# EAGLE design scT (EAGLE 8.6.3)
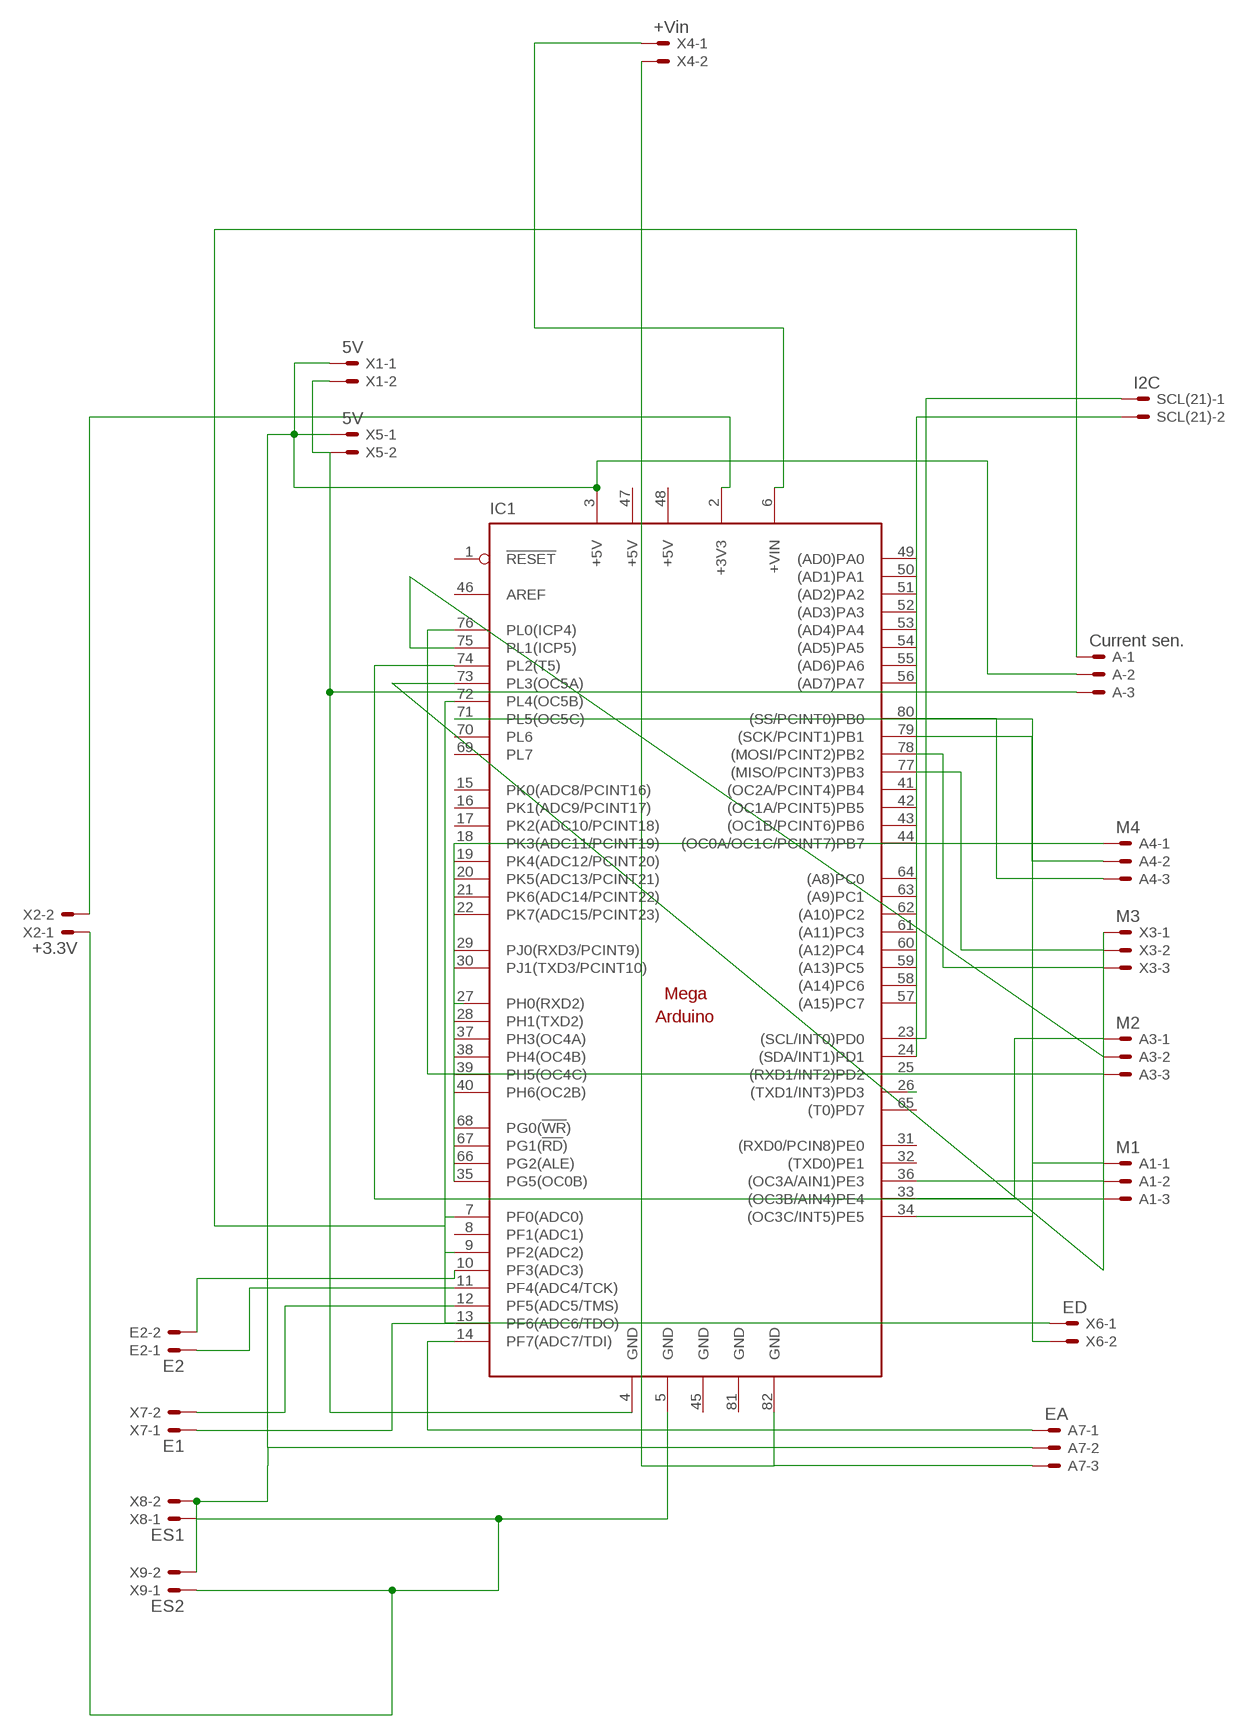
[diagram p0: schematic, sheet 1]

## Parts
A  Current sen.  JST-XH-03-PIN-LONG-PAD  [JST-XH-03-PACKAGE-LONG-PAD]
A1  M1  JST-XH-03-PIN-LONG-PAD  [JST-XH-03-PACKAGE-LONG-PAD]
A3  M2  JST-XH-03-PIN-LONG-PAD  [JST-XH-03-PACKAGE-LONG-PAD]
A4  M4  JST-XH-03-PIN-LONG-PAD  [JST-XH-03-PACKAGE-LONG-PAD]
A7  EA  JST-XH-03-PIN-LONG-PAD  [JST-XH-03-PACKAGE-LONG-PAD]
E2  E2  JST-XH-02-PIN-LONG-PAD  [JST-XH-02-PACKAGE-LONG-PAD]
IC1  MEGAARDUINO_11  [MEGA_ARDUINO_1]
SCL(21)  I2C  JST-XH-02-PIN-LONG-PAD  [JST-XH-02-PACKAGE-LONG-PAD]
X1  5V  JST-XH-02-PIN-LONG-PAD  [JST-XH-02-PACKAGE-LONG-PAD]
X2  +3.3V  JST-XH-02-PIN-LONG-PAD  [JST-XH-02-PACKAGE-LONG-PAD]
X3  M3  JST-XH-03-PIN-LONG-PAD  [JST-XH-03-PACKAGE-LONG-PAD]
X4  +Vin  JST-XH-02-PIN-LONG-PAD  [JST-XH-02-PACKAGE-LONG-PAD]
X5  5V  JST-XH-02-PIN-LONG-PAD  [JST-XH-02-PACKAGE-LONG-PAD]
X6  ED  JST-XH-02-PIN-LONG-PAD  [JST-XH-02-PACKAGE-LONG-PAD]
X7  E1  JST-XH-02-PIN-LONG-PAD  [JST-XH-02-PACKAGE-LONG-PAD]
X8  ES1  JST-XH-02-PIN-LONG-PAD  [JST-XH-02-PACKAGE-LONG-PAD]
X9  ES2  JST-XH-02-PIN-LONG-PAD  [JST-XH-02-PACKAGE-LONG-PAD]

## Nets
N$1: IC1.12(PF5(ADC5/TMS)) X7.2
N$2: A4.1 IC1.35(PG5(OC0B))
N$3: IC1.27(PH0(RXD2))
N$4: IC1.26((TXD1/INT3)PD3)
N$5: A4.2 IC1.79((SCK/PCINT1)PB1)
N$6: IC1.25((RXD1/INT2)PD2)
N$7: IC1.36((OC3A/AIN1)PE3) X3.1
N$8: A3.2 IC1.75(PL1(ICP5))
N$9: A3.1 IC1.33((OC3B/AIN4)PE4)
N$10: A1.1 IC1.34((OC3C/INT5)PE5)
N$11: IC1.77((MISO/PCINT3)PB3) X3.2
N$12: A3.3 IC1.76(PL0(ICP4))
N$13: IC1.2(+3V3) X2.2
N$14: A.1 IC1.7(PF0(ADC0))
N$15: A.3 IC1.4(GND) X1.2 X5.2
N$16: A4.3 IC1.80((SS/PCINT0)PB0)
N$17: IC1.9(PF2(ADC2))
N$18: E2.2 IC1.10(PF3(ADC3))
N$19: E2.1 IC1.11(PF4(ADC4/TCK))
N$20: IC1.78((MOSI/PCINT2)PB2) X3.3
N$21: IC1.13(PF6(ADC6/TDO)) X7.1
N$22: A1.2 IC1.73(PL3(OC5A))
N$23: A1.3 IC1.74(PL2(T5))
N$24: IC1.5(GND) X2.1 X8.1 X9.1
N$25: A7.2 A.2 IC1.3(+5V) X1.1 X5.1 X8.2 X9.2
N$26: IC1.72(PL4(OC5B)) X6.1
N$27: IC1.71(PL5(OC5C)) X6.2
N$28: A7.1 IC1.14(PF7(ADC7/TDI))
N$29: A7.3 IC1.82(GND) X4.2
N$30: IC1.23((SCL/INT0)PD0) SCL(21).1
N$31: IC1.24((SDA/INT1)PD1) SCL(21).2
N$32: IC1.6(+VIN) X4.1
Unconnected: IC1.1(!RESET) IC1.8(PF1(ADC1)) IC1.15(PK0(ADC8/PCINT16)) IC1.16(PK1(ADC9/PCINT17)) IC1.17(PK2(ADC10/PCINT18)) IC1.18(PK3(ADC11/PCINT19)) IC1.19(PK4(ADC12/PCINT20)) IC1.20(PK5(ADC13/PCINT21)) IC1.21(PK6(ADC14/PCINT22)) IC1.22(PK7(ADC15/PCINT23)) IC1.28(PH1(TXD2)) IC1.29(PJ0(RXD3/PCINT9)) IC1.30(PJ1(TXD3/PCINT10)) IC1.31((RXD0/PCIN8)PE0) IC1.32((TXD0)PE1) IC1.37(PH3(OC4A)) IC1.38(PH4(OC4B)) IC1.39(PH5(OC4C)) IC1.40(PH6(OC2B)) IC1.41((OC2A/PCINT4)PB4) IC1.42((OC1A/PCINT5)PB5) IC1.43((OC1B/PCINT6)PB6) IC1.44((OC0A/OC1C/PCINT7)PB7) IC1.46(AREF) IC1.49((AD0)PA0) IC1.50((AD1)PA1) IC1.51((AD2)PA2) IC1.52((AD3)PA3) IC1.53((AD4)PA4) IC1.54((AD5)PA5) IC1.55((AD6)PA6) IC1.56((AD7)PA7) IC1.57((A15)PC7) IC1.58((A14)PC6) IC1.59((A13)PC5) IC1.60((A12)PC4) IC1.61((A11)PC3) IC1.62((A10)PC2) IC1.63((A9)PC1) IC1.64((A8)PC0) IC1.65((T0)PD7) IC1.66(PG2(ALE)) IC1.67(PG1(!RD!)) IC1.68(PG0(!WR!)) IC1.69(PL7) IC1.70(PL6)

## Power pins joined to a net without a drawn wire
+5V: IC1.47(+5V) IC1.48(+5V)
GND: IC1.45(GND) IC1.81(GND)

## Library data of the parts
A A1 A3 A4 A7 X3 = jstt:JST-XH-03-PIN: JST XH Connector 2 Pin Wire to board connector. Pitch: 2,54 mm, (0.100") Number of pins: 3 Created by Rembrandt Electronics www.rembrandtelectronics.com
E2 SCL(21) X1 X2 X4-X9 = jstt:JST-XH-02-PIN: JST XH Connector 2 Pin Wire to board connector. Pitch: 2,54 mm, (0.100") Number of pins: 2 Created by Rembrandt Electronics www.rembrandtelectronics.com
IC1 = arduino:MEGAARDUINO_1: The Arduino Mega is a microcontroller board based on the ATmega1280. - 54 digital input/output pins (of which 14 can be used as PWM outputs) - 16 analog inputs - 4 UARTs (hardware serial ports) - 16 MHz crystal oscillator - USB connection - power jack - ICSP header - reset button It contains everything needed to support the microcontroller; simply connect it to a computer with a USB cable or power it with a AC-to-DC adapter or battery to get started. The Mega is compatible with most shields designed for the Arduino Duemilanove or Diecimila. http://arduino.cc/en/Main/ArduinoBoardMega

## Board
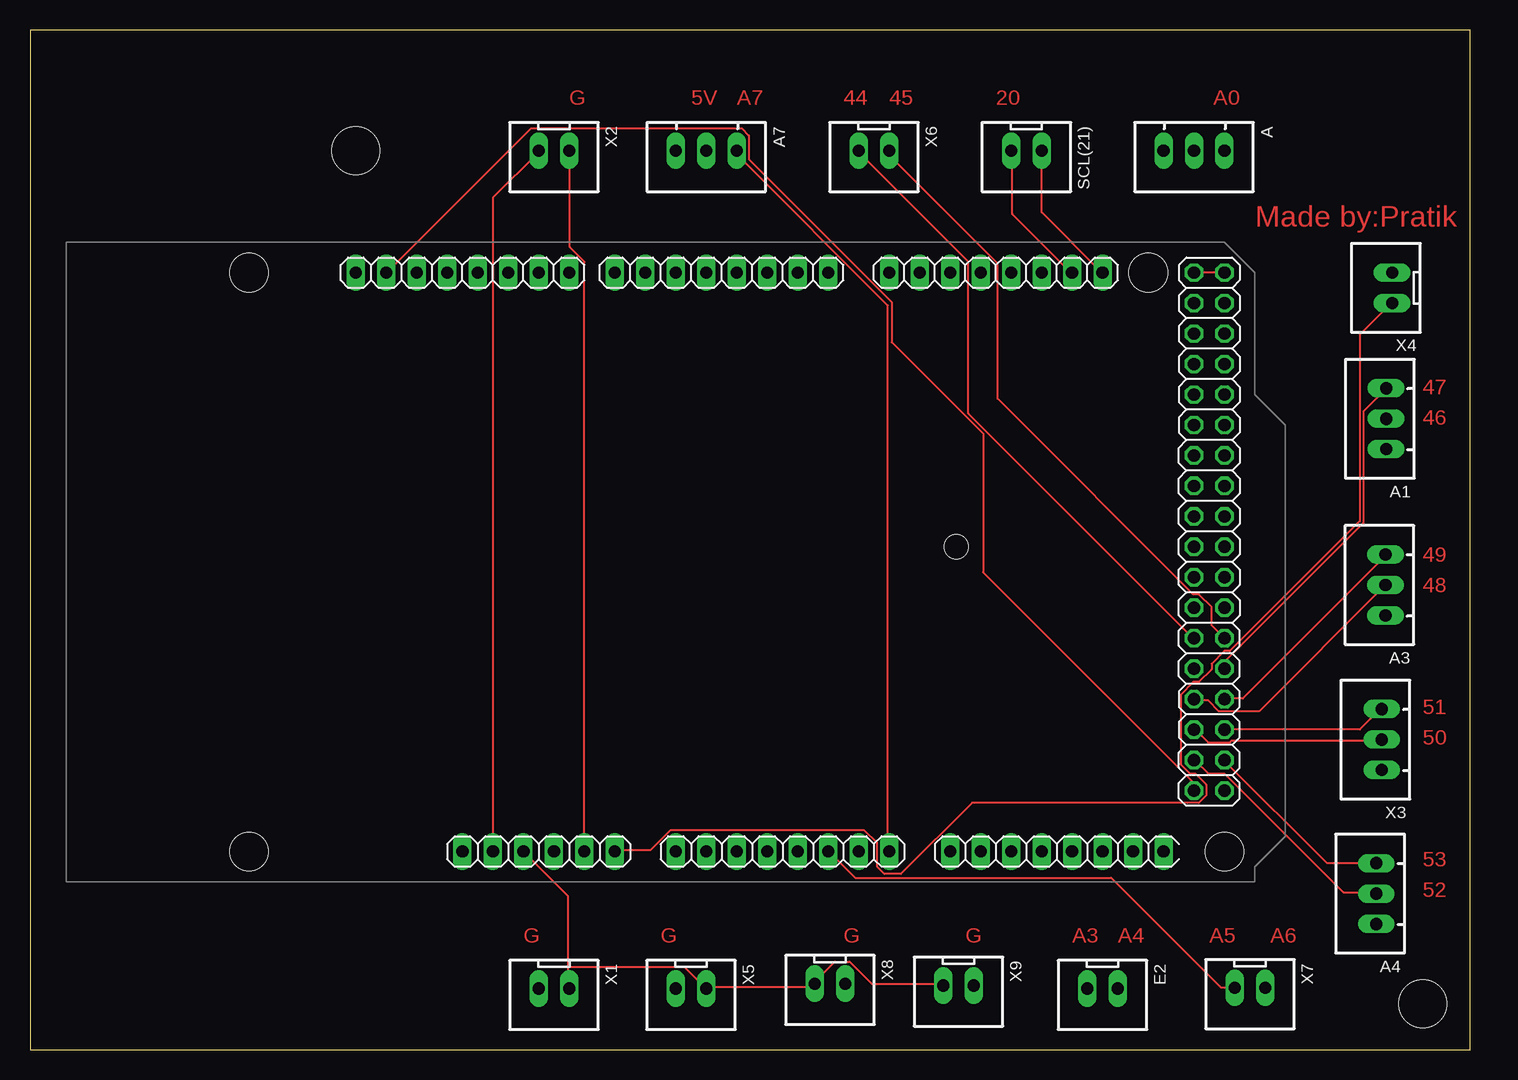
[diagram p1: board, top side]
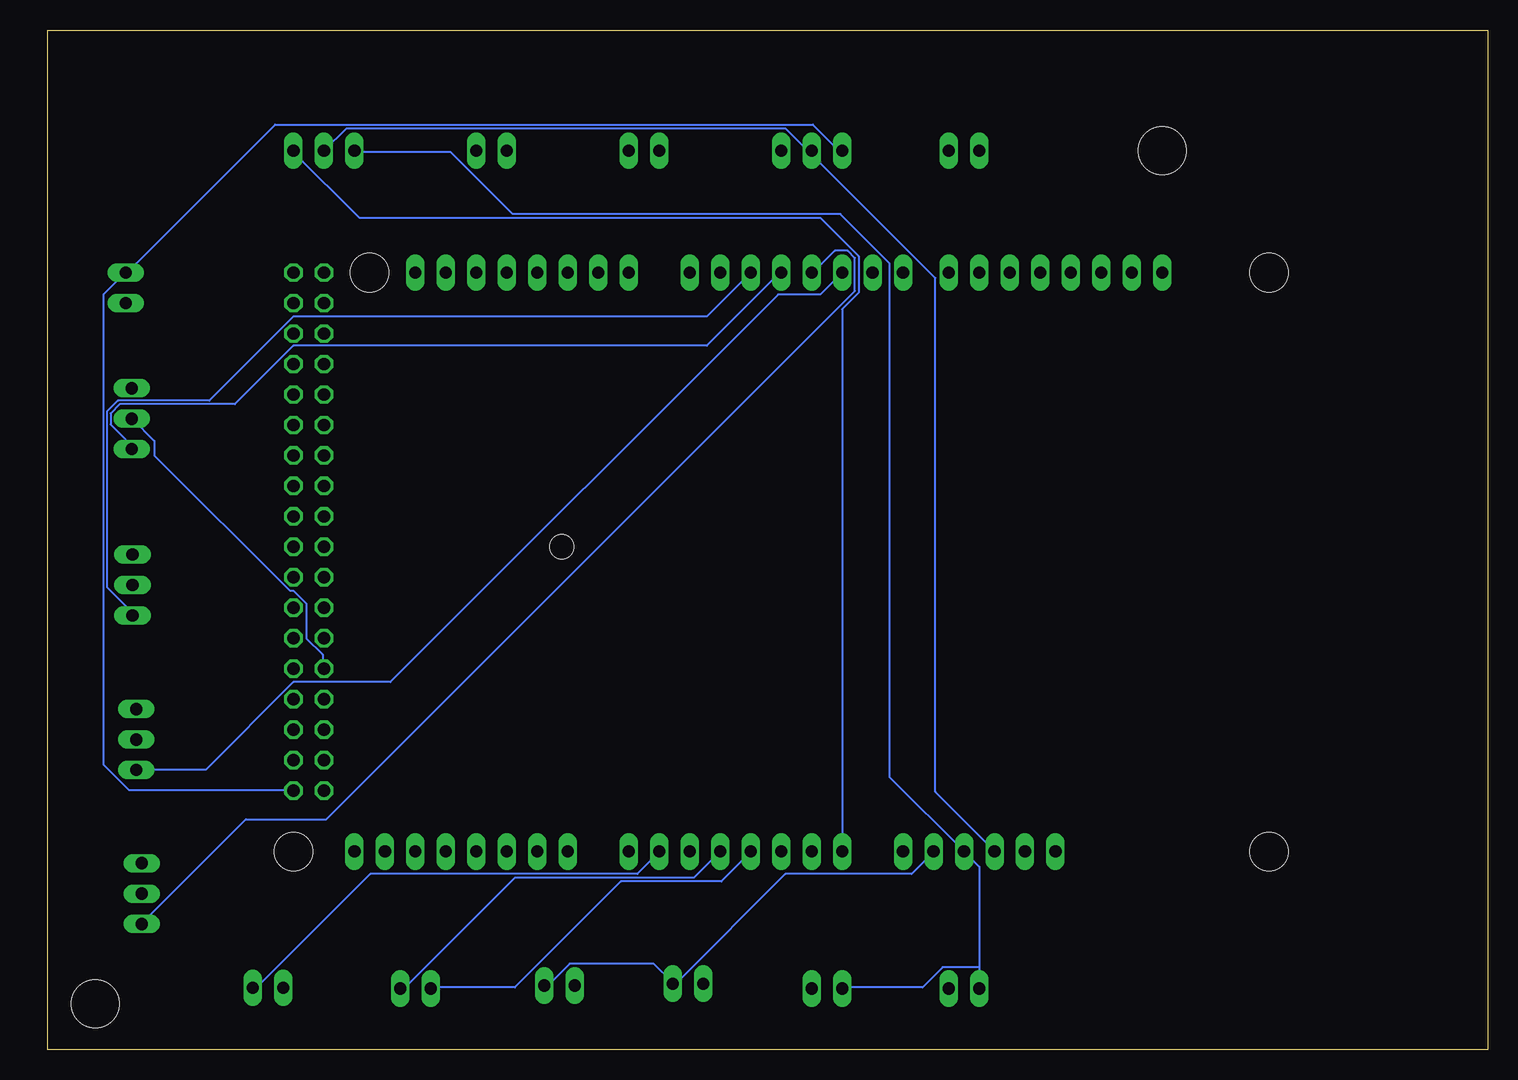
[diagram p2: board, bottom side, seen from below]

Size 120 x 85 mm. Coordinates in mm from the lower left corner, seen from the top.
Outline: 0,0 120,0 120,85 0,85 0,0
Copper layers (1*16): Top 0.035mm / dielectric 1.5mm / Bottom 0.035mm
Design rules "default": minimum track width 6mil, minimum drill 0.35mm, track to track 6mil, track to pad 6mil, pad to pad 6mil, via to via 6mil, smd to smd 6mil, copper to edge 40mil, drill to drill 6mil, minimum pad ring 10mil, minimum via ring 8mil, stop-mask expansion 4mil, vias tented up to drill 0mil, thermal gap 10mil
Holes 4 mm at 116.05,3.81 27.15,74.93

### Footprints (pad centres in the part's own frame; a part is rotated, then mirrored left to right if it is on the bottom)
JST-XH-03-PACKAGE-LONG-PAD = drill 1.016 long: 1 -2.54,0; 2 0,0; 3 2.54,0
JST-XH-02-PACKAGE-LONG-PAD = drill 1.016 long: 1 -1.27,0; 2 1.27,0
MEGA_ARDUINO_1 = drill 1.016 long: 1 33.02,2.54; 2 35.56,2.54; 3 38.1,2.54; 4 40.64,2.54; 5 43.18,2.54; 6 45.72,2.54; 7 50.8,2.54; 8 53.34,2.54; 9 55.88,2.54; 10 58.42,2.54; 11 60.96,2.54; 12 63.5,2.54; 13 66.04,2.54; 14 68.58,2.54; 15 73.66,2.54; 16 76.2,2.54; 17 78.74,2.54; 18 81.28,2.54; 19 83.82,2.54; 20 86.36,2.54; 21 88.9,2.54; 22 91.44,2.54; 23 86.36,50.8; 24 83.82,50.8; 25 81.28,50.8; 26 78.74,50.8; 27 76.2,50.8; 28 73.66,50.8; 29 71.12,50.8; 30 68.58,50.8; 31 63.5,50.8; 32 60.96,50.8; 33 58.42,50.8; 34 55.88,50.8; 35 53.34,50.8; 36 50.8,50.8; 37 48.26,50.8; 38 45.72,50.8; 39 41.91,50.8; 40 39.37,50.8; 41 36.83,50.8; 42 34.29,50.8; 43 31.75,50.8; 44 29.21,50.8; 45 26.67,50.8; 46 24.13,50.8 | drill 1.016 octagon: 47 93.98,50.8; 48 96.52,50.8; 49 93.98,48.26; 50 96.52,48.26; 51 93.98,45.72; 52 96.52,45.72; 53 93.98,43.18; 54 96.52,43.18; 55 93.98,40.64; 56 96.52,40.64; 57 93.98,38.1; 58 96.52,38.1; 59 93.98,35.56; 60 96.52,35.56; 61 93.98,33.02; 62 96.52,33.02; 63 93.98,30.48; 64 96.52,30.48; 65 93.98,27.94; 66 96.52,27.94; 67 93.98,25.4; 68 96.52,25.4; 69 93.98,22.86; 70 96.52,22.86; 71 93.98,20.32; 72 96.52,20.32; 73 93.98,17.78; 74 96.52,17.78; 75 93.98,15.24; 76 96.52,15.24; 77 93.98,12.7; 78 96.52,12.7; 79 93.98,10.16; 80 96.52,10.16; 81 93.98,7.62; 82 96.52,7.62 | hole 3.2: 15.24,50.8; 15.24,2.54; 90.17,50.8; 96.52,2.54 | hole 2: 74.168,27.94

### Placement (x,y rotation side)
A  97,74.93 180 top
A1  113.01,52.59 90 top
A3  112.96,38.73 90 top
A4  112.19,13 90 top
A7  56.36,74.93 180 top
E2  89.38,5.08 180 top
IC1  3.02,13.97 0 top
SCL(21)  83.03,74.93 180 top
X1  43.66,5.08 180 top
X2  43.66,74.93 180 top
X3  112.64,25.84 90 top
X4  113.51,63.5 90 top
X5  55.09,5.08 180 top
X6  70.33,74.93 180 top
X7  101.66,5.14 180 top
X8  66.67,5.49 180 top
X9  77.37,5.34 180 top

### Tracks (layer width: path | path; a pad name or v marks a point on that pad's centre or on a via)
+5V
  Top 0.152: IC1.48 IC1.47
GND
  Top 0.152: IC1.81 96.95,21.64 96.95,22.25 79.42,39.78 79.42,51.36 71.8,58.98 71.8,62.33 59.92,74.22 59.92,76.2 59.31,76.81 41.78,76.81 29.74,64.77 IC1.45
N$1
  Top 0.152: X7.2 100.3,5.18 99.24,5.18 90.09,14.33 68.75,14.33 66.62,16.46 IC1.12
N$2
  Bottom 0.152: IC1.35 56.26,64.77 54.43,66.6 53.36,66.6 52.75,65.99 52.75,63.25 96.8,19.2 103.5,19.2 112.19,10.52 A4.1
N$5
  Top 0.152: A4.2 112.19,13.11 109.45,13.11 99.54,23.01 98.17,23.01 97.1,24.08 IC1.79
N$7
  Bottom 0.152: IC1.36 55.65,62.94 59.15,62.94 91.46,30.63 99.54,30.63 106.85,23.32 112.49,23.32 X3.1
N$8
  Top 0.152: IC1.75 97.1,29.11 98.17,29.11 99.08,28.19 102.44,28.19 112.95,38.71 A3.2
N$9
  Bottom 0.152: IC1.33 65.1,61.11 99.54,61.11 106.55,54.1 114.17,54.1 115.09,53.19 115.09,38.56 113.1,36.58 113.1,36.27 A3.1
N$10
  Bottom 0.152: A1.1 113.1,50.14 113.1,50.44 114.78,52.12 114.78,53.03 114.02,53.8 104.42,53.8 99.54,58.67 65.1,58.67 59,64.77 IC1.34
N$11
  Top 0.152: X3.2 112.49,25.76 100.15,25.76 100,25.6 98.17,25.6 97.1,26.67 IC1.77
N$12
  Top 0.152: IC1.76 99.54,29.26 101.06,29.26 112.95,41.15 A3.3
N$13
  Top 0.152: IC1.2 38.58,71.02 42.39,74.83 X2.2
N$14
  Bottom 0.152: IC1.7 53.82,61.72 52.45,63.09 52.45,66.14 55.65,69.34 94.05,69.34 99.54,74.83 A.1
N$15
  Bottom 0.152: 42.39,6.86 42.39,15.24 IC1.4 49.86,22.71 49.86,65.53 53.97,69.65 81.25,69.65 86.43,74.83 94.36,74.83 A.3 | 42.39,6.86 X1.2 | 42.39,6.86 45.44,6.86 47.11,5.18 53.82,5.18 X5.2
N$16
  Top 0.152: A4.3 108.07,15.54 99.54,24.08 IC1.80
N$18
  Bottom 0.152: E2.2 88.11,5.18 81.1,5.18 72.26,14.02 63.88,14.02 61.44,16.46 IC1.10
N$19
  Bottom 0.152: IC1.11 66.16,14.33 81.1,14.33 90.24,5.18 90.55,5.18 E2.1
N$20
  Top 0.152: IC1.78 110.82,26.67 112.49,28.35 X3.3
N$21
  Bottom 0.152: X7.1 102.89,5.18 102.59,5.18 93.14,14.63 70.89,14.63 69.06,16.46 IC1.13
N$22
  Bottom 0.152: IC1.73 97.1,31.85 97.1,32.92 98.47,34.29 98.47,37.19 99.54,38.25 99.84,38.25 111.12,49.53 111.12,50.75 112.95,52.58 A1.2
N$23
  Top 0.152: IC1.74 99.54,32.31 111.12,43.89 111.12,53.19 112.95,55.02 A1.3
N$24
  Top 0.152: IC1.5 46.2,65.68 44.98,66.9 44.98,74.83 X2.1
  Bottom 0.152: X9.1 78.51,5.49 78.2,5.49 76.53,7.16 69.52,7.16 67.99,5.64 X8.1 67.84,5.64 67.54,5.64 58.54,14.63 48.03,14.63 46.2,16.46 IC1.5
N$25
  Top 0.152: 44.83,6.86 44.83,12.8 IC1.3 | 44.83,6.86 44.83,5.18 X1.1 | X9.2 76.07,5.49 70.13,5.49 68.3,7.32 67.08,7.32 65.4,5.64 X8.2 65.25,5.49 64.94,5.18 56.41,5.18 X5.1 54.58,6.86 44.83,6.86
  Bottom 0.152: A.2 95.12,76.81 58.54,76.81 56.72,74.98 56.41,74.98 A7.2 56.26,74.83 56.26,74.52 46.05,64.31 46.05,21.49 41.17,16.61 IC1.3
N$26
  Top 0.152: IC1.72 98.47,35.36 98.47,36.88 97.41,37.95 96.95,37.95 80.64,54.25 80.64,65.53 71.65,74.52 71.65,74.83 X6.1
N$27
  Top 0.152: X6.2 69.06,74.83 78.2,65.68 78.2,53.03 96.95,34.29 IC1.71
N$28
  Top 0.152: A7.1 59,74.83 59,74.52 71.5,62.03 71.5,16.61 IC1.14
N$29
  Bottom 0.152: A7.3 53.82,74.98 54.12,74.98 56.26,77.11 101.06,77.11 113.41,64.77 X4.2 113.56,64.77 115.39,62.94 115.39,23.77 113.26,21.64 99.54,21.64 IC1.82
N$30
  Top 0.152: SCL(21).1 84.3,69.8 89.33,64.77 IC1.23
N$31
  Top 0.152: SCL(21).2 81.86,74.83 81.86,69.65 86.74,64.77 IC1.24
N$32
  Top 0.152: IC1.6 48.79,16.61 51.69,16.61 53.36,18.29 69.52,18.29 70.58,17.22 70.58,15.24 71.19,14.63 72.56,14.63 78.51,20.57 97.41,20.57 98.02,21.18 98.02,22.1 97.1,23.01 96.64,23.01 95.88,23.77 95.88,29.57 96.95,30.63 97.41,30.63 98.47,31.7 98.47,32.16 99.54,33.22 100,33.22 110.82,44.04 110.82,59.59 113.41,62.18 X4.1

### Text on the board
Top: A0 | G | 5V | A7 | 44 | 45 | 20 | Made by:Pratik | 47 | 46 | 49 | 48 | 51 | 50 | 53 | 52 | G | G | G | G | A3 | A4 | A5 | A6